# Altium schematic sheet Heater_ADC.SchDoc
size OrCAD A
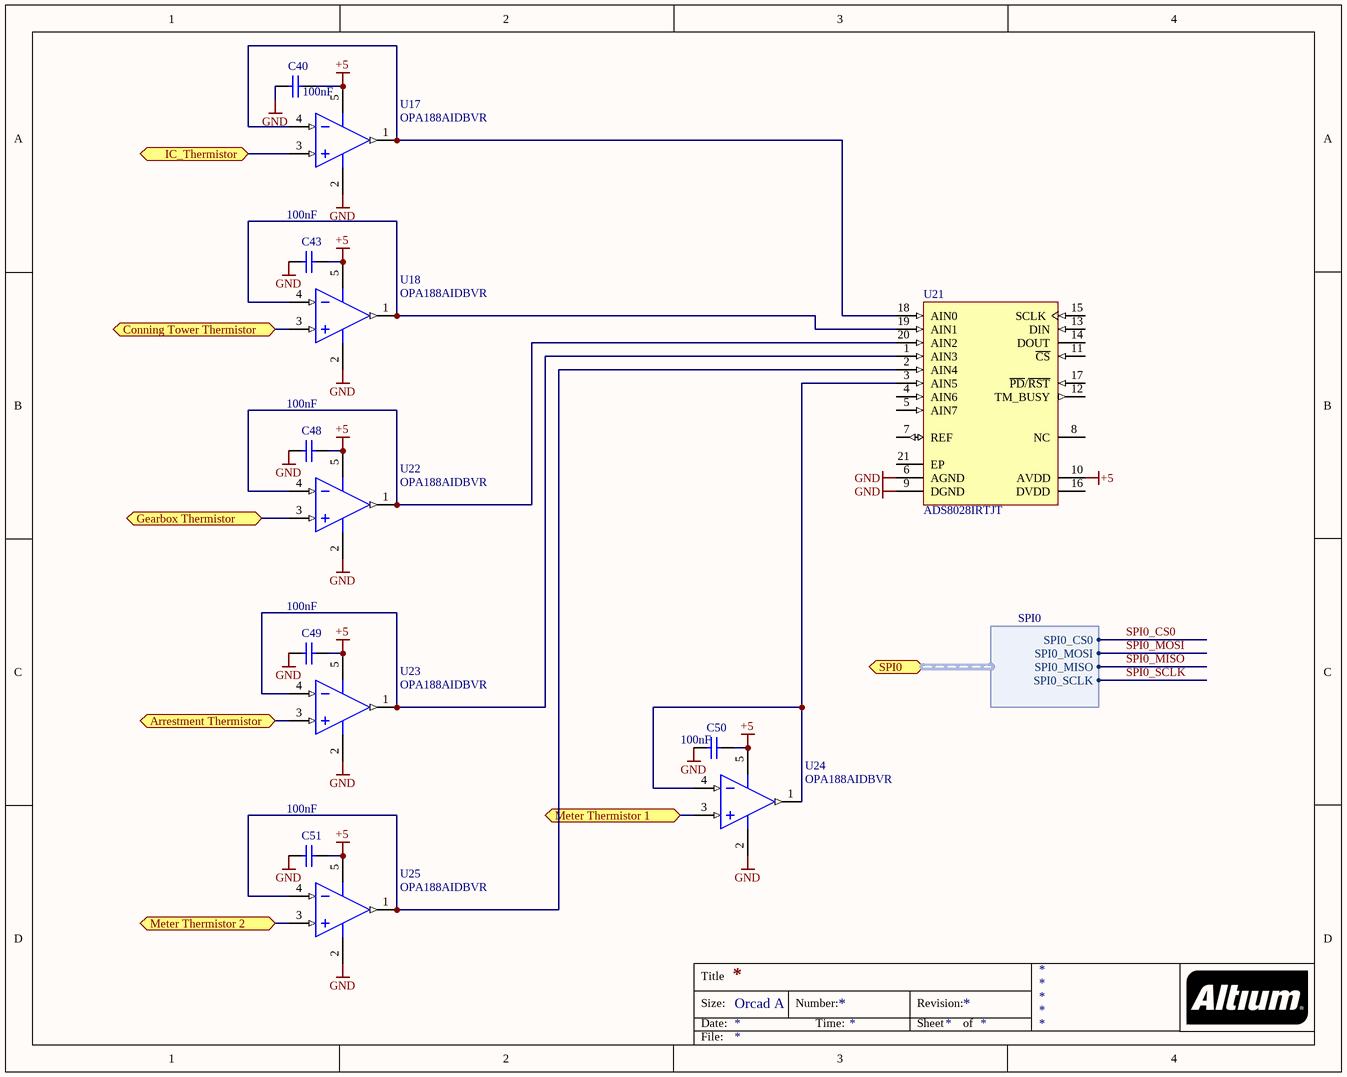
[diagram p0: Heater_ADC.SchDoc]

## Parts
C40  Capacitance: 100nF  [CAPC0402(1005)60_L]
C43  Capacitance: 100nF  [CAPC0402(1005)60_L]
C48  Capacitance: 100nF  [CAPC0402(1005)60_L]
C49  Capacitance: 100nF  [CAPC0402(1005)60_L]
C50  Capacitance: 100nF  [CAPC0402(1005)60_L]
C51  Capacitance: 100nF  [CAPC0402(1005)60_L]
U17  OPA188AIDBVR  [DBV0005A_M]
U18  OPA188AIDBVR  [DBV0005A_M]
U21  ADS8028IRTJT  [TI-RTJ20-2600X2600TP_V]
U22  OPA188AIDBVR  [DBV0005A_M]
U23  OPA188AIDBVR  [DBV0005A_M]
U24  OPA188AIDBVR  [DBV0005A_M]
U25  OPA188AIDBVR  [DBV0005A_M]

## Ports
Arrestment Thermistor, Conning Tower Thermistor, Gearbox Thermistor, IC_Thermistor, Meter Thermistor 1, Meter Thermistor 2, SPI0 (harness SPI0)

## Harnesses
SPI0: SPI0_CS0, SPI0_MOSI, SPI0_MISO, SPI0_SCLK

## Nets
+5: C40.2 C43.2 C48.2 C49.2 C50.2 C51.2 U17.5(V+) U18.5(V+) U21.10(AVDD) U22.5(V+) U23.5(V+) U24.5(V+) U25.5(V+)
GND: C40.1 C43.1 C48.1 C49.1 C50.1 C51.1 U17.2(V-) U18.2(V-) U21.6(AGND) U21.9(DGND) U22.2(V-) U23.2(V-) U24.2(V-) U25.2(V-)
Arrestment Thermistor: U23.3(IN+) ; port Arrestment Thermistor
Conning Tower Thermistor: U18.3(IN+) ; port Conning Tower Thermistor
Gearbox Thermistor: U22.3(IN+) ; port Gearbox Thermistor
IC_Thermistor: U17.3(IN+) ; port IC_Thermistor
Meter Thermistor 1: U24.3(IN+) ; port Meter Thermistor 1
Meter Thermistor 2: U25.3(IN+) ; port Meter Thermistor 2
SPI0_CS0: port SPI0.SPI0_CS0
SPI0_MISO: port SPI0.SPI0_MISO
SPI0_MOSI: port SPI0.SPI0_MOSI
SPI0_SCLK: port SPI0.SPI0_SCLK
NetU17_1: U17.1(OUT) U17.4(IN-) U21.18(AIN0)
NetU18_1: U18.1(OUT) U18.4(IN-) U21.19(AIN1)
NetU21_1: U21.1(AIN3) U23.1(OUT) U23.4(IN-)
NetU21_2: U21.2(AIN4) U25.1(OUT) U25.4(IN-)
NetU21_3: U21.3(AIN5) U24.1(OUT) U24.4(IN-)
NetU21_20: U21.20(AIN2) U22.1(OUT) U22.4(IN-)

Not connected (* = marked no-connect by the designer): U21 4(AIN6) 5(AIN7) 7(REF) 8(NC) 11(~{CS}) 12(TM_BUSY) 13(DIN) 14(DOUT) 15(SCLK) 16(DVDD) 17(~{PD}/~{RST}) 21(EP)

## Notes on the sheet
- Title
- Size:
- Date:
- Orcad A
- Number:
- Time:
- Revision:
- Sheet
- of
- File:

## Library data of the parts
C40 C43 C48-C51 = CMP-1034-01343-1: Manufacturer: Kemet; Manufacturer Part Number: C0402C104K4RACAUTO; Dielectric Material: Ceramic; Tolerance: 10%; Voltage Rating: 16V; Dielectric: X7R; Dissipation Factor: 3.5%; Supplier 1: Mouser; Supplier Part Number 1: 80-C0402C104K4RAUTO; Stock 1: 120173; Pricing 1: 1=0.1, 10=0.07, 50=0.07, 100=0.07, 1000=0.059, 10000=0.042 (USD); Mount: Surface Mount; Case/Package: 0402; Case Code (Imperial): 0402; Case Code (Metric): 1005; Min Operating Temperature: -55°C; Max Operating Temperature: 125°C; Packaging: Tape and Reel; Package Quantity: 10000; Voltage Rating (DC): 16V; Termination: SMD/SMT; Length: 1mm; Height: 0.5mm; Width: 0.5mm; Thickness: 0.022inch; Depth: 0.5mm; Radiation Hardening: No; REACH SVHC: No SVHC; ComponentLink1URL: https://datasheet.ciiva.com/6254/datasheetpn-c0402c104k4racauto-6254625.pdf; ComponentLink1Description: https://datasheet.ciiva.com/6254/datasheetpn-c0402c104k4racauto-6254625.pdf; ComponentLink2URL: https://datasheet.ciiva.com/5999/1730444-5999370.pdf; ComponentLink2Description: https://datasheet.ciiva.com/5999/1730444-5999370.pdf; ComponentLink3URL: https://datasheet.ciiva.com/7747/1730444-7747437.pdf; ComponentLink3Description: https://datasheet.ciiva.com/7747/1730444-7747437.pdf; ComponentLink4URL: https://datasheet.ciiva.com/22693/1730444-22693870.pdf; ComponentLink4Description: https://datasheet.ciiva.com/22693/1730444-22693870.pdf
U17 U18 U22-U25 = CMP-0809-00005-2: Precision, Low Noise, Rail-to-Rail Output, Zero-Drift Operational Amplifier, 4 to 36 V, -40 to 125 degC, 5-pin SOT23 (DBV5), Green (RoHS & no Sb/Br); Manufacturer: Texas Instruments; Total Supply Voltage(Min)(+5V is 5, +/-5V is 10): 4; Offset Drift(Typ)(uV/C): 0.03; Rating: Catalog; SubFamily: Zero Drift Precision Amplifier; GBW(Typ)(MHz): 2; Slew Rate(Typ)(V/us): 0.8; Number of Channels: 1; CMRR(Min)(dB): 120; Iq per channel(Max)(mA): 0.51; Total Supply Voltage(Max)(+5V is 5, +/-5V is 10): 36; PartNumber: OPA188AIDBVR; ComponentLink2Description: Datasheet; ComponentLink2URL: http://www.ti.com/lit/ds/symlink/opa188.pdf; ComponentLink1Description: Manufacturer URL; Mounting Technology: Surface Mount; Eco-Plan: Green (RoHS & no Sb/Br); ComponentLink1URL: http://www.ti.com/; PackageVersion: 4073253-4/K, 03/2006; DatasheetVersion: SBOS642A; ComponentLink3Description: Package Specification; PackageReference: DBV0005A; ComponentLink3URL: http://www.ti.com/litv/pdf/mpds018i; PackageDescription: 5-Pin Plastic Small Outline, Body 1.6 x 2.9 mm, Pitch 0.95 mm; Code_JEDEC: MO-178
U21 = CMP-0003-02168-1: 12-Bit, 8-channel, 1 MSPS, SAR ADC with Internal Reference and Internal Temperature Sensor, -40 to 125 degC, 20-pin QFN (RTJ20), Green (RoHS & no Sb/Br); Manufacturer: Texas Instruments; Digital Supply(Min)(V): 1.65; Resolution(Bits): 12; Digital Supply(Max)(V): 5.25; SNR(dB): 72; # Input Channels: 8; Sample Rate (max)(SPS): 1M; SINAD(dB): 71; Interface: Serial SPI; SFDR(dB): 84; SubFamily: Precision ADC (<=10MSPS); Analog Voltage AV/DD(Min)(V): 2.7; INL(Max)(+/-LSB): 1; ComponentLink2Description: Datasheet; DatasheetVersion: SBAS549B; Architecture: SAR; PartNumber: ADS8028IRTJT; Mounting Technology: Surface Mount; Eco-Plan: Green (RoHS & no Sb/Br); ComponentLink1Description: Manufacturer URL; ComponentLink3Description: Package Specification; PackageDescription: 20-Pin Plastic Flat Pack, Body 4 X 4 mm, Pitch 0.5 mm; ComponentLink1URL: http://www.ti.com/; Analog Voltage AV/DD(Max)(V): 5.25; PackageVersion: 4205505/F, 07/2011; ComponentLink2URL: http://www.ti.com/general/docs/lit/getliterature.tsp?genericPartNumber=ADS8028&fileType=pdf; PackageReference: RTJ20-2600X2600TP; ComponentLink3URL: http://www.ti.com/lit/ml/mpqf156e/mpqf156e.pdf